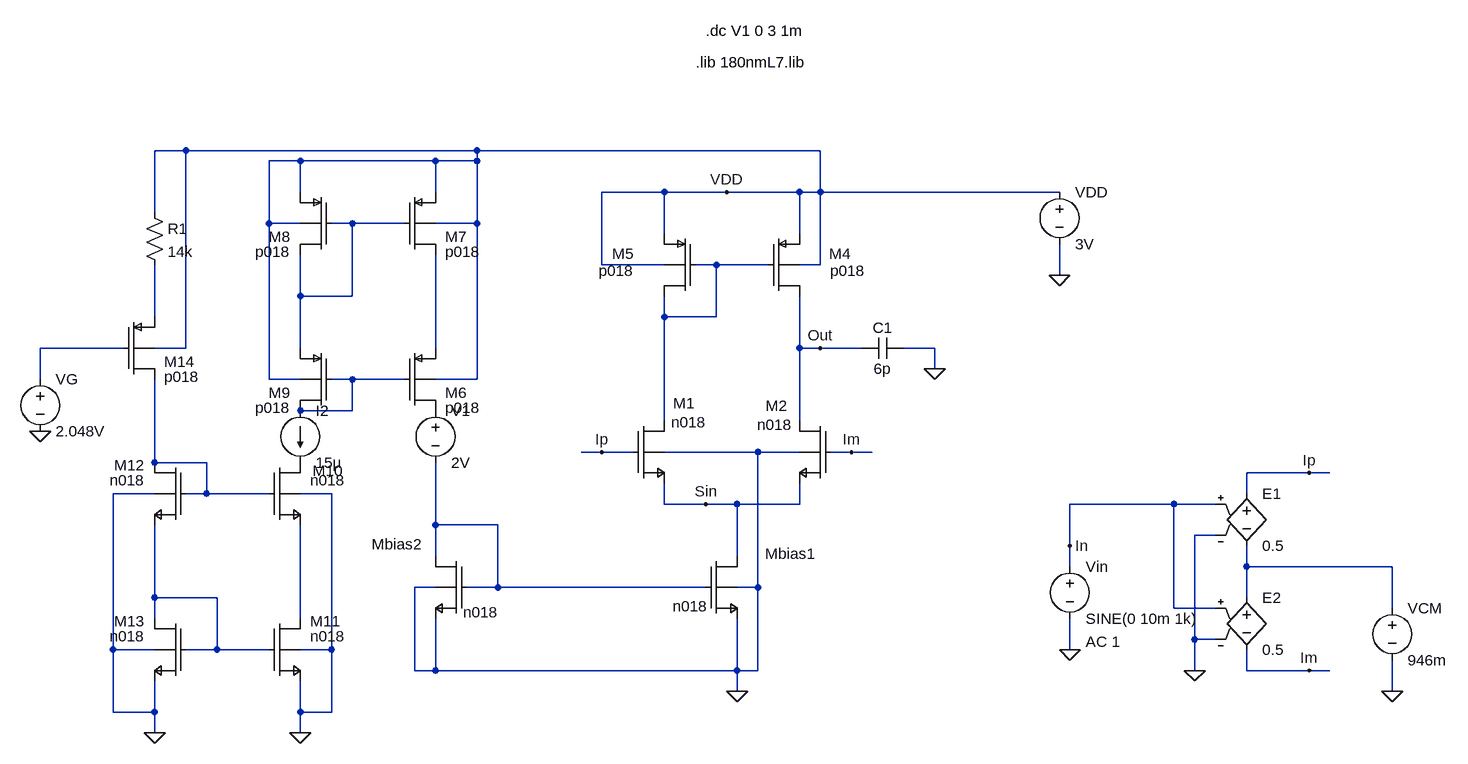
[diagram p0: schematic Simulare_finala_dc_R(out).asc]
Simulare_finala_dc_R(out).asc, the LTspice schematic file:
Version 4
SHEET 1 1764 680
WIRE -816 -512 -864 -512
WIRE -368 -512 -816 -512
WIRE 160 -512 -368 -512
WIRE -640 -496 -688 -496
WIRE -432 -496 -640 -496
WIRE -368 -496 -368 -512
WIRE -368 -496 -432 -496
WIRE -640 -448 -640 -496
WIRE -432 -448 -432 -496
WIRE -80 -448 -176 -448
WIRE 16 -448 -80 -448
WIRE 128 -448 16 -448
WIRE 160 -448 160 -512
WIRE 160 -448 128 -448
WIRE 528 -448 160 -448
WIRE -864 -416 -864 -512
WIRE -688 -400 -688 -496
WIRE -640 -400 -688 -400
WIRE -560 -400 -592 -400
WIRE -480 -400 -560 -400
WIRE -368 -400 -368 -496
WIRE -368 -400 -432 -400
WIRE -80 -384 -80 -448
WIRE 128 -384 128 -448
WIRE -176 -336 -176 -448
WIRE -80 -336 -176 -336
WIRE 0 -336 -32 -336
WIRE 80 -336 0 -336
WIRE 160 -336 160 -448
WIRE 160 -336 128 -336
WIRE 528 -320 528 -368
WIRE -640 -288 -640 -352
WIRE -560 -288 -560 -400
WIRE -560 -288 -640 -288
WIRE -864 -256 -864 -336
WIRE -80 -256 -80 -288
WIRE 0 -256 0 -336
WIRE 0 -256 -80 -256
WIRE -912 -208 -1040 -208
WIRE -816 -208 -816 -512
WIRE -816 -208 -864 -208
WIRE -640 -208 -640 -288
WIRE -432 -208 -432 -352
WIRE 128 -208 128 -288
WIRE 160 -208 128 -208
WIRE 224 -208 160 -208
WIRE 336 -208 288 -208
WIRE 336 -176 336 -208
WIRE -1040 -160 -1040 -208
WIRE -688 -160 -688 -400
WIRE -640 -160 -688 -160
WIRE -560 -160 -592 -160
WIRE -480 -160 -560 -160
WIRE -368 -160 -368 -400
WIRE -368 -160 -432 -160
WIRE -560 -112 -560 -160
WIRE -560 -112 -640 -112
WIRE -80 -96 -80 -256
WIRE 128 -96 128 -208
WIRE -176 -48 -208 -48
WIRE -128 -48 -176 -48
WIRE 64 -48 -80 -48
WIRE 128 -48 64 -48
WIRE 208 -48 176 -48
WIRE 240 -48 208 -48
WIRE -864 -32 -864 -160
WIRE -784 -32 -864 -32
WIRE 912 -16 816 -16
WIRE 944 -16 912 -16
WIRE -864 16 -928 16
WIRE -784 16 -784 -32
WIRE -784 16 -816 16
WIRE -688 16 -784 16
WIRE -592 16 -640 16
WIRE 816 16 816 -16
WIRE -80 32 -80 0
WIRE -16 32 -80 32
WIRE 32 32 -16 32
WIRE 128 32 128 0
WIRE 128 32 32 32
WIRE 704 32 544 32
WIRE 768 32 704 32
WIRE -432 64 -432 -32
WIRE -336 64 -432 64
WIRE 768 80 736 80
WIRE 544 96 544 32
WIRE -432 112 -432 64
WIRE 32 112 32 32
WIRE 544 128 544 96
WIRE 816 128 816 96
WIRE 1040 128 816 128
WIRE -432 160 -464 160
WIRE -336 160 -336 64
WIRE -336 160 -384 160
WIRE -16 160 -336 160
WIRE 64 160 64 -48
WIRE 64 160 32 160
WIRE -864 176 -864 64
WIRE -768 176 -864 176
WIRE 816 176 816 128
WIRE 704 192 704 32
WIRE 768 192 704 192
WIRE 1040 192 1040 128
WIRE -864 208 -864 176
WIRE -640 208 -640 64
WIRE 736 240 736 80
WIRE 768 240 736 240
WIRE -928 256 -928 16
WIRE -864 256 -928 256
WIRE -768 256 -768 176
WIRE -768 256 -816 256
WIRE -688 256 -768 256
WIRE -592 256 -592 16
WIRE -592 256 -640 256
WIRE 544 256 544 208
WIRE -464 288 -464 160
WIRE -432 288 -432 208
WIRE -432 288 -464 288
WIRE 32 288 32 208
WIRE 32 288 -432 288
WIRE 64 288 64 160
WIRE 64 288 32 288
WIRE 736 288 736 240
WIRE 816 288 816 256
WIRE 912 288 816 288
WIRE 944 288 912 288
WIRE 32 320 32 288
WIRE 1040 320 1040 272
WIRE -928 352 -928 256
WIRE -864 352 -864 304
WIRE -864 352 -928 352
WIRE -640 352 -640 304
WIRE -592 352 -592 256
WIRE -592 352 -640 352
WIRE -864 384 -864 352
WIRE -640 384 -640 352
FLAG 32 320 0
FLAG 528 -320 0
FLAG 544 96 In
FLAG -176 -48 Ip
FLAG 544 256 0
FLAG 736 288 0
FLAG 1040 320 0
FLAG 912 -16 Ip
FLAG 912 288 Im
FLAG -16 32 Sin
FLAG 208 -48 Im
FLAG 16 -448 VDD
FLAG 336 -176 0
FLAG 160 -208 Out
FLAG -1040 -80 0
FLAG -864 384 0
FLAG -640 384 0
SYMBOL voltage 528 -464 R0
WINDOW 123 0 0 Left 2
WINDOW 39 0 0 Left 2
SYMATTR InstName VDD
SYMATTR Value 3V
SYMBOL nmosb -128 -96 R0
WINDOW 0 62 -27 Left 2
WINDOW 3 59 2 Left 2
SYMATTR InstName M1
SYMATTR Value n018
SYMATTR Value2 l=1u w=54.14u ad=10.82p as=10.82p pd=108.68u ps=108.68u m=1
SYMBOL nmosb -16 112 R0
WINDOW 0 91 -4 Left 2
WINDOW 3 -51 77 Left 2
SYMATTR InstName Mbias1
SYMATTR Value n018
SYMATTR Value2 l=1u w=115.3u ad=23.06p as=23.06p pd=231u ps=231u m=1
SYMBOL cap 288 -192 M270
WINDOW 0 32 32 VTop 2
WINDOW 3 0 32 VBottom 2
SYMATTR InstName C1
SYMATTR Value 6p
SYMBOL voltage 544 112 R0
WINDOW 123 24 132 Left 2
WINDOW 39 0 0 Left 2
SYMATTR Value2 AC 1
SYMATTR InstName Vin
SYMATTR Value SINE(0 10m 1k)
SYMBOL nmosb 176 -96 M0
WINDOW 0 66 -23 Left 2
WINDOW 3 59 6 Left 2
SYMATTR InstName M2
SYMATTR Value n018
SYMATTR Value2 l=1u w=54.14u ad=10.82p as=10.82p pd=108.68u ps=108.68u m=1
SYMBOL nmosb -384 112 M0
WINDOW 0 68 -18 Left 2
WINDOW 3 -49 86 Left 2
SYMATTR InstName Mbias2
SYMATTR Value n018
SYMATTR Value2 l=1u w=2.16u ad=0.43p as=0.43p pd=4.72u ps=4.72u m=1
SYMBOL e 816 0 R0
SYMATTR InstName E1
SYMATTR Value 0.5
SYMBOL e 816 160 R0
SYMATTR InstName E2
SYMATTR Value 0.5
SYMBOL voltage 1040 176 R0
WINDOW 123 24 132 Left 2
WINDOW 39 0 0 Left 2
SYMATTR InstName VCM
SYMATTR Value 946m
SYMBOL pmosb 80 -384 R0
WINDOW 0 94 31 Left 2
WINDOW 3 95 57 Left 2
SYMATTR InstName M4
SYMATTR Value p018
SYMATTR Value2 l=1u w=183.86u ad=36.77p as=36.77p pd=368.12u ps=368.12u m=1
SYMBOL pmosb -32 -384 M0
WINDOW 0 94 31 Left 2
WINDOW 3 95 57 Left 2
SYMATTR InstName M5
SYMATTR Value p018
SYMATTR Value2 l=1u w=183.86u ad=36.77p as=36.77p pd=368.12u ps=368.12u m=1
SYMBOL pmosb -480 -208 R0
SYMATTR InstName M6
SYMATTR Value p018
SYMATTR Value2 l=1u w=9.6u ad=1.92p as=1.92p pd=19.6u ps=19.6u m=1
SYMBOL pmosb -480 -448 R0
SYMATTR InstName M7
SYMATTR Value p018
SYMATTR Value2 l=1u w=7.42u ad=1.48p as=1.48p pd=15.24u ps=15.24u m=1
SYMBOL pmosb -592 -448 M0
SYMATTR InstName M8
SYMATTR Value p018
SYMATTR Value2 l=1u w=7.42u ad=1.48p as=1.48p pd=15.24u ps=15.24u m=1
SYMBOL pmosb -592 -208 M0
SYMATTR InstName M9
SYMATTR Value p018
SYMATTR Value2 l=1u w=8.8u ad=1.76p as=1.76p pd=18u ps=18u m=1
SYMBOL nmosb -688 -32 R0
WINDOW 0 67 13 Left 2
SYMATTR InstName M10
SYMATTR Value n018
SYMATTR Value2 l=1u w=2.72u ad=0.54p as=0.54p pd=5.84u ps=5.84u m=1
SYMBOL nmosb -688 208 R0
SYMATTR InstName M11
SYMATTR Value n018
SYMATTR Value2 l=1u w=2.16u ad=0.43p as=0.43p pd=4.72u ps=4.72u m=1
SYMBOL nmosb -816 -32 M0
SYMATTR InstName M12
SYMATTR Value n018
SYMATTR Value2 l=1u w=2.6u ad=0.52p as=0.52p pd=5.6u ps=5.6u m=1
SYMBOL nmosb -816 208 M0
SYMATTR InstName M13
SYMATTR Value n018
SYMATTR Value2 l=1u w=2.16u ad=0.43p as=0.43p pd=4.72u ps=4.72u m=1
SYMBOL pmosb -912 -256 R0
SYMATTR InstName M14
SYMATTR Value p018
SYMATTR Value2 l=1u w=9.6u ad=1.92p as=1.92p pd=19.6u ps=19.6u m=1
SYMBOL voltage -1040 -176 R0
WINDOW 123 0 0 Left 0
WINDOW 39 0 0 Left 0
SYMATTR InstName VG
SYMATTR Value 2.048V
SYMBOL res -880 -432 R0
SYMATTR InstName R1
SYMATTR Value 14k
SYMBOL voltage -432 -128 R0
WINDOW 123 0 0 Left 0
WINDOW 39 0 0 Left 0
SYMATTR InstName V1
SYMATTR Value 2V
SYMBOL current -640 -112 R0
WINDOW 123 0 0 Left 0
WINDOW 39 0 0 Left 0
SYMATTR InstName I2
SYMATTR Value 15µ
TEXT -32 -648 Left 2 !.lib 180nmL7.lib
TEXT -16 -696 Left 2 !.dc V1 0 3 1m

The netlist it stands for:
* Simulare_finala_dc_R(out).asc
VDD VDD 0 3V
M1 N002 Ip Sin 0 n018 l=1u w=54.14u ad=10.82p as=10.82p pd=108.68u ps=108.68u m=1
Mbias1 Sin N008 0 0 n018 l=1u w=115.3u ad=23.06p as=23.06p pd=231u ps=231u m=1
C1 0 Out 6p
Vin In 0 SINE(0 10m 1k) AC 1
M2 Out Im Sin 0 n018 l=1u w=54.14u ad=10.82p as=10.82p pd=108.68u ps=108.68u m=1
Mbias2 N008 N008 0 0 n018 l=1u w=2.16u ad=0.43p as=0.43p pd=4.72u ps=4.72u m=1
E1 Ip N009 In 0 0.5
E2 N009 Im In 0 0.5
VCM N009 0 946m
M4 Out N002 VDD VDD p018 l=1u w=183.86u ad=36.77p as=36.77p pd=368.12u ps=368.12u m=1
M5 N002 N002 VDD VDD p018 l=1u w=183.86u ad=36.77p as=36.77p pd=368.12u ps=368.12u m=1
M6 P001 N006 N005 VDD p018 l=1u w=9.6u ad=1.92p as=1.92p pd=19.6u ps=19.6u m=1
M7 N005 N001 VDD VDD p018 l=1u w=7.42u ad=1.48p as=1.48p pd=15.24u ps=15.24u m=1
M8 N001 N001 VDD VDD p018 l=1u w=7.42u ad=1.48p as=1.48p pd=15.24u ps=15.24u m=1
M9 N006 N006 N001 VDD p018 l=1u w=8.8u ad=1.76p as=1.76p pd=18u ps=18u m=1
M10 P002 N007 N011 0 n018 l=1u w=2.72u ad=0.54p as=0.54p pd=5.84u ps=5.84u m=1
M11 N011 N010 0 0 n018 l=1u w=2.16u ad=0.43p as=0.43p pd=4.72u ps=4.72u m=1
M12 N007 N007 N010 0 n018 l=1u w=2.6u ad=0.52p as=0.52p pd=5.6u ps=5.6u m=1
M13 N010 N010 0 0 n018 l=1u w=2.16u ad=0.43p as=0.43p pd=4.72u ps=4.72u m=1
M14 N007 N004 N003 VDD p018 l=1u w=9.6u ad=1.92p as=1.92p pd=19.6u ps=19.6u m=1
VG N004 0 2.048V
R1 VDD N003 14k
V1 P001 N008 2V
I2 N006 P002 15µ
.model NMOS NMOS
.model PMOS PMOS
.lib standard.mos
.lib 180nmL7.lib
.dc V1 0 3 1m
.backanno
.end